# EasyEDA Pro project ProProject_minifoc_test_4.0_2024-05-25.epro

# Schematic schematic1_1
Create Date: 2024-03-08; Page Name: P1; Project Name: minifoc_test_4.0; Schematic Name: schematic1_1; Update Date: 2024-03-08; Company: 嘉立创EDA; Drawed: hlchen2021; Page Size: A4; Reviewed: hlchen2021; Version: V1.0
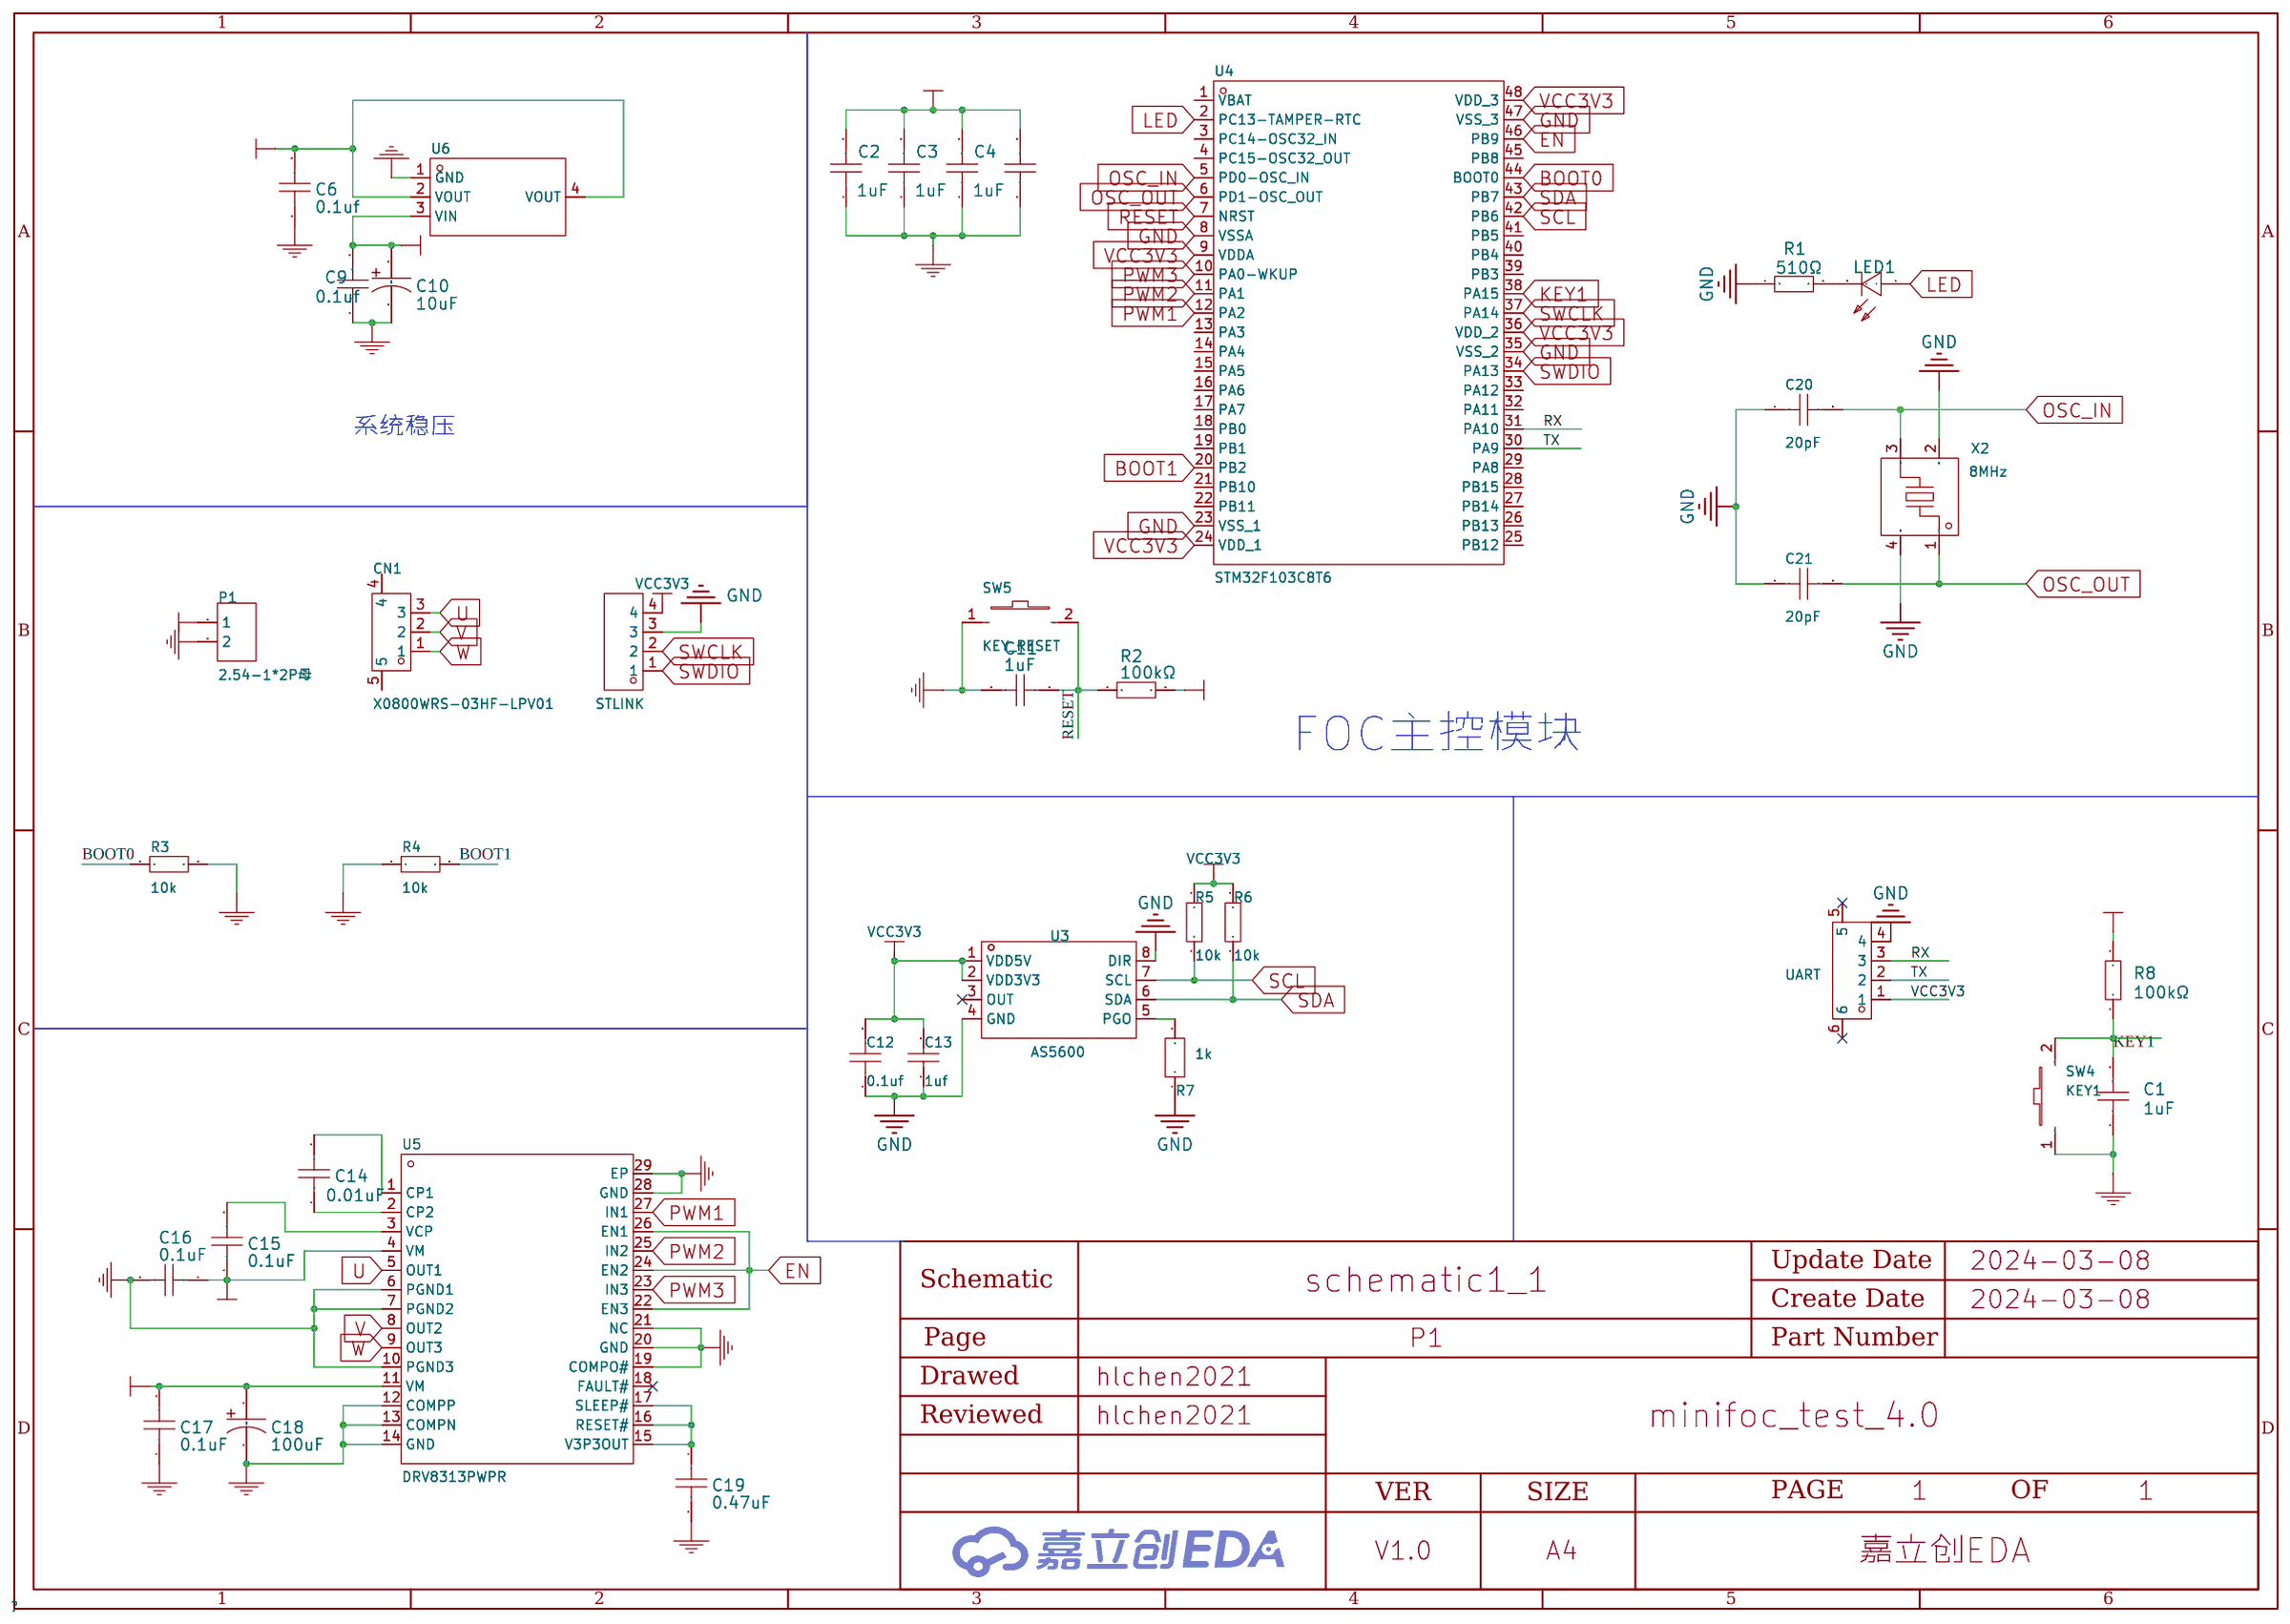
[diagram p0: schematic sheet]

## Parts
C1  1uF  [C0603]
C2  1uF  [C0603]
C3  1uF  [C0603]
C4  1uF  [C0603]
C5  1uF  [C0603]
C6  0.1uf  [C0603]
C9  0.1uf  [C0603]
C10  10uF  [CAP-SMD_L3.2-W1.6-RD]
C11  1uF  [C0603]
C12  100nF  [C0603]
C13  1uF  [C0603]
C14  0.01uF  [C0603]
C15  0.1uF  [C0603]
C16  0.1uF  [C0603]
C17  0.1uF  [C0603]
C18  100uF  [CAP-SMD_L6.0-W3.2-R-RD]
C19  0.47uF  [C0603]
C20  20pF  [C0603]
C21  20pF  [C0603]
CN1  X0800WRS-03HF-LPV01  [CONN-SMD_X0800WRS-03HF-LPV01]
LED1  FC-DA1608HRK-620D  [LED0603-FD]
P1  2.54-1*2P母  [HDR-TH_2P-P2.54-V-F]
R1  510Ω  [R0603]
R2  100kΩ  [R0603]
R3  10kΩ  [R0603]
R4  10kΩ  [R0603]
R5  10kΩ  [R0603]
R6  10kΩ  [R0603]
R7  1k  [R0603]
R8  100kΩ  [R0603]
STLINK  2.54-1*4P反弯排针  [HDR-TH_4P-P2.54-H-M-W10.4]
SW4  KEY1  [SW-SMD_L4.0-W2.9-LS5.0]
SW5  KEY_RESET  [SW-SMD_L4.0-W2.9-LS5.0]
U3  AS5600  [SOIC-8_L5.0-W4.0-P1.27-LS6.0-BL]
U4  STM32F103C8T6  [LQFP-48_L7.0-W7.0-P0.50-LS9.0-BL]
U5  DRV8313PWPR  [HTSSOP-28_L9.8-W4.5-P0.65-LS6.6-BL-EP]
U6  AMS1117-3.3  [SOT-223-3_L6.5-W3.4-P2.30-LS7.0-BR]
UART  HDGC1002WR-S-4P  [CONN-SMD_4P-P1.00_HDGC_HDGC1002WR-S-4P]
X2  8MHz  [OSC-SMD_4P-L3.2-W2.5-BL]

## Library data of the parts
C1-C5 C11 C13 = 0603F105M160NT: 容值:1uF;精度:±20%;额定电压:16V;材质(温度系数):Y5V;; LCSC Part Name: 1uF ±20% 16V; Supplier Part: C1689; Manufacturer: FH(风华); Supplier Footprint: 0603; JLCPCB Part Class: Extended Part; Datasheet: https://atta.szlcsc.com/upload/public/pdf/source/20170923/C1689_1506149319442988473.pdf; Supplier: LCSC; Tolerance: ±20%; Voltage Rated: 16V; Temperature Coefficient: Y5V
C6 C9 = 0.1uf
C10 = TC212A106M010A: Supplier: LCSC; Manufacturer: Sunlord; Supplier Part: C97063; JLCPCB Part Class: Extended Part
C12 = CC0603KRX7R9BB104: 容值:100nF;精度:±10%;额定电压:50V;材质(温度系数):X7R;; LCSC Part Name: 100nF ±10% 50V; Supplier Part: C14663; Manufacturer: YAGEO(国巨); Supplier Footprint: 0603; JLCPCB Part Class: Basic Part; Datasheet: https://atta.szlcsc.com/upload/public/pdf/source/20170116/1484561234239.pdf; Supplier: LCSC; Tolerance: ±10%; Voltage Rated: 50V; Temperature Coefficient: X7R
C14 = 0.01uF
C15-C17 = 0.1uF
C18 = CA45-C-10V-100μF-K: Supplier: LCSC; Manufacturer: TORCH; Supplier Part: C171664; JLCPCB Part Class: Extend
C19 = 0.47uF
C20 C21 = 0603CG200J101NT: 容值:20pF;精度:±5%;额定电压:100V;材质(温度系数):C0G;额定电压(VAC):-;; LCSC Part Name: 20pF ±5% 100V; Supplier Part: C2762329; Manufacturer: FH(风华); Supplier Footprint: 0603; JLCPCB Part Class: 扩展库; Datasheet: https://atta.szlcsc.com/upload/public/pdf/source/20211026/1B9CC6FF40D574A190437DF0D5F8F6A6.pdf; Supplier: LCSC; Tolerance: ±5%; Voltage Rated: 100V; Temperature Coefficient: C0G
CN1 = X0800WRS-03HF-LPV01: 插针结构:1x3P;间距:0.8mm;安装方式:卧贴;行距:-;总PIN数:3P;排数:1;每排PIN数:3;参考系列:-;额定电流:500mA;触头材质:磷青铜;触头镀层:金;工作温度范围:-25℃~+85℃;; LCSC Part Name: 1x3P 间距:0.8mm 卧贴 镀金 替代JST; Supplier Part: C500138; Manufacturer: XKB Connectivity(中国星坤); Supplier Footprint: SMD,P=0.8mm,卧贴; JLCPCB Part Class: 扩展库; Datasheet: https://atta.szlcsc.com/upload/public/pdf/source/20211011/3A0802A09DD608D3DCC2D13C156B7911.pdf; Supplier: LCSC; Pins Structure: 1x3P; Pitch: 0.8mm; Mounting Style: 卧贴; Number of Pins: 3P; Number of Rows: 1; Number of PINs Per Row: 3; Current Rating (Max): 500mA; Contact Material: 磷青铜; Contact Plating: 金; Operating Temperature Range: -25℃~+85℃
LED1 = FC-DA1608HRK-620D: Supplier: LCSC; Manufacturer: NATIONSTAR; Supplier Part: C84263; JLCPCB Part Class: Extended Part
P1 = 2.54-1*2P母: 排数:单排;总孔位数:2P;间距:2.54mm;插孔结构:1x2P;行距:-;安装类型:直插;塑高:-;触头材质:-;触头镀层:-;; LCSC Part Name: 间距:2.54mm 1x2P 直插; Supplier Part: C49661; Manufacturer: BOOMELE(博穆精密); Supplier Footprint: 插件,P=2.54mm; Datasheet: https://atta.szlcsc.com/upload/public/pdf/source/20210301/C2718488_F4427B881E42CAA8DDB0B1C12B3A522C.pdf; Supplier: LCSC; Number of Rows: 单排; Number of Holes: 2P; Pitch: 2.54mm; Holes Structure: 1x2P; Mounting Type: 直插
R1 = RS-03K511JT: Supplier: LCSC; Manufacturer: FH; Supplier Part: C73811; Resistance: 510; JLCPCB Part Class: Extended Part
R2 R8 = HoLTT0603-1/10W-100KR-1%: 阻值:100kΩ;功率:100mW;; LCSC Part Name: 100kΩ 100mW; Supplier Part: C2904537; Manufacturer: Milliohm(毫欧); Supplier Footprint: 0603; JLCPCB Part Class: Extended Part; Datasheet: https://atta.szlcsc.com/upload/public/pdf/source/20211021/528351F376078D6228C985A842C3763C.pdf; Supplier: LCSC; Power(Watts): 100mW
R3-R6 = 0603WAF1002T5E: 电阻类型:厚膜电阻;阻值:10kΩ;精度:±1%;功率:100mW;温度系数:±100ppm/;最大工作电压:75V;工作温度范围:-55~+155;; LCSC Part Name: 10kΩ ±1% 100mW; Supplier Part: C25804; Manufacturer: UNI-ROYAL(厚声); Supplier Footprint: 0603; JLCPCB Part Class: 基础库; Datasheet: https://atta.szlcsc.com/upload/public/pdf/source/20200306/C422600_1E6D84923E4A46A82E41ADD87F860B5C.pdf; Supplier: LCSC; Type: 厚膜电阻; Tolerance: ±1%; Power(Watts): 100mW; Temperature Coefficient: ±100ppm/; Overload Voltage (Max): 75V; Operating Temperature Range: -55~+155
R7 = SCR0603J1K: LCSC Part Name: ±5% 1K; Supplier Part: C3017736; Manufacturer: VO(翔胜); Supplier Footprint: 0603; JLCPCB Part Class: Extended Part; Datasheet: https://atta.szlcsc.com/upload/public/pdf/source/20220513/247AF9639BA21CF93567DC289CCC6A22.pdf; Supplier: LCSC
STLINK = 2.54-1*4P反弯排针: 间距:2.54mm;总PIN位数:4;排数:1;插针结构:1x4P;行距:-;安装类型:弯插;圆针/方针:方针;额定电流:3A;额定电压:-;配合针长度:6mm;塑高:-;端接针长度:-;触头材质:-;触头镀层:-;工作温度范围:-55~+105;颜色:黑色;; LCSC Part Name: 2.54mm 1x4P 弯插 方针; Supplier Part: C91552; Manufacturer: BOOMELE(博穆精密); Supplier Footprint: 弯插,P=2.54mm; JLCPCB Part Class: Extended Part; Datasheet: https://atta.szlcsc.com/upload/public/pdf/source/20190508/C74252_03DDEC4696EE17172E44B96636392962.pdf; Supplier: LCSC; Pitch: 2.54mm; Number of Pins: 4; Number of Rows: 1; Pin Structure: 1x4P; Mounting Type: 弯插; Circluar Pins/Square Pins: 方针; Current Rating (Max): 3A; Length of Mating Pin: 6mm; Operating Temperature Range: -55~+105; Color: 黑色
SW4 SW5 = KEY-3*4*2: Supplier Part: C9900015662; Supplier Footprint: KEY; JLCPCB Part Class: 扩展库; Datasheet: https://atta.szlcsc.comnull; Supplier: LCSC
U3 = AS5600-ASOM: 非接触12bit磁角度位置传感器; Supplier Part: C79815; Manufacturer: ams(艾迈斯半导体); Supplier Footprint: SOIC-8_150mil; JLCPCB Part Class: 扩展库; Datasheet: https://atta.szlcsc.com/upload/public/pdf/source/20161027/1477535527192.pdf; Supplier: LCSC
U4 = STM32F103C8T6: CPU内核:ARM Cortex-M3;CPU最大主频:72MHz;工作电压范围:2V~3.6V;内部振荡器:有;程序 FLASH容量:64K@x8bit;RAM总容量:20KB;EEPROM/数据 FLASH容量:-;GPIO端口数量:37;ADC(单元数/通道数/位数):1@x10ch/12bit;外设/功能/协议栈:温度传感器；DMA；看门狗；POR；PWM;工作温度范围:-40~+85;; LCSC Part Name: ARM Cortex-M3 72MHz 64K@x8bit 20KB MSL=3; Supplier Part: C8734; Manufacturer: ST(意法半导体); Supplier Footprint: LQFP-48_7x7x05P; JLCPCB Part Class: 基础库; Datasheet: https://atta.szlcsc.com/upload/public/pdf/source/20140724/1457707174202.pdf; Supplier: LCSC; CPU Core: ARM Cortex-M3; Maximum Frequency: 72MHz; Supply Voltage Range: 2V~3.6V; Internal Oscillator: 有; Program FLASH Size: 64K@x8bit; RAM Size: 20KB; GPIO Ports Number: 37; ADC (Units/Channels/bits): 1@x10ch/12bit; Peripherals / Functions / Protocol Stacks: 温度传感器；DMA；看门狗；POR；PWM; Operating Temperature Range: -40~+85
U5 = DRV8313PWPR: DRV8313 三路 1/2 H 桥驱动器 IC; Supplier Part: C92482; Manufacturer: TI(德州仪器); Supplier Footprint: HTSSOP-28; JLCPCB Part Class: 扩展库; Datasheet: https://atta.szlcsc.com/upload/public/pdf/source/20180307/C92482_15204091381071407760.pdf; Supplier: LCSC
U6 = AMS1117-3.3_C6186: 输出类型:固定;输出极性:正;输出通道数:1;最大输入电压:-;输出电压:3.3V;压差:1.3V@(800mA);静态电流(地电流):-;输出电流:1A;电源纹波抑制比(PSRR):72dB@(120Hz);噪声:-;特性:-;工作温度:-;; LCSC Part Name: Vout=3.3V 1A 72dB@(120Hz); Supplier Part: C6186; Manufacturer: 美国AMS; Supplier Footprint: SOT-223; JLCPCB Part Class: Basic Part; Datasheet: https://atta.szlcsc.com/upload/public/pdf/source/20180727/C6186_7A095716F0823C02F1997A905E26C086.pdf; Supplier: LCSC; Output Type: 固定; Output Polarity: 正; Number of Outputs: 1; Output Voltage: 3.3V; Dropout Voltage: 1.3V@(800mA); Output Current: 1A; Power Supply Rejection Ratio (PSRR): 72dB@(120Hz)
UART = HDGC1002WR-S-4P: 参考系列:-;间距:1mm;插针结构:1x4P;排数:1;每排PIN数:4;行距:-;公母:公型插针;安装方式:卧贴;额定电流:1A;工作温度范围:-25~+70;; LCSC Part Name: SH1.0针座卧贴 4P; Supplier Part: C2936214; Manufacturer: HDGC(华德共创); Supplier Footprint: SMD,P=1mm; JLCPCB Part Class: 扩展库; Datasheet: https://atta.szlcsc.com/upload/public/pdf/source/20211229/E8A09E85670B5E97244D2008A24D97FE.pdf; Supplier: LCSC; Pitch: 1mm; Pins Structure: 1x4P; Number of Rows: 1; Number of PINs Per Row: 4; Gender: 公型插针; Mounting Style: 卧贴; Current Rating (Max): 1A; Operating Temperature Range: -25~+70
X2 = 3225-8.00-10-10-10/A: 晶振类型:贴片无源晶振;频率:8MHz;频率公差:±10ppm;频率稳定度:-;负载电容:10pF;工作温度:-;; LCSC Part Name: 8MHz ±10ppm 10pF; Supplier Part: C518154; Manufacturer: LIMING(利明); Supplier Footprint: SMD3225-4P; JLCPCB Part Class: 扩展库; Datasheet: https://atta.szlcsc.com/upload/public/pdf/source/20200603/C518143_C28693AFC6B5677A46756E3C75F63174.pdf; Supplier: LCSC; Crystal Type: 贴片无源晶振; Frequency Tolerance: ±10ppm; Load Capacitance: 10pF

## Nets
GND: C1.1 C2.1 C3.1 C4.1 C5.1 C6.1 C9.1 C10.2 C11.1 C12.1 C13.1 C16.2 C17.1 C18.2 C19.2 C20.1 C21.1 P1.2 R1.1 R3.2 R4.1 R7.1 STLINK.3 SW4.1 SW5.1 U3.4(GND) U3.8(DIR) U4.8(VSSA) U4.23(VSS_1) U4.35(VSS_2) U4.47(VSS_3) U5.6(PGND1) U5.7(PGND2) U5.10(PGND3) U5.12(COMPP) U5.13(COMPN) U5.14(GND) U5.19(COMPO#) U5.20(GND) U5.21(NC) U5.28(GND) U5.29(EP) U6.1(GND) UART.4 X2.2(GND) X2.4(GND)
VCC: C9.2 C10.1 C15.1 C16.1 C17.2 C18.1 P1.1 U5.4(VM) U5.11(VM) U6.3(VIN)
VCC3V3: C2.2 C3.2 C4.2 C5.2 C6.2 C12.2 C13.2 R2.2 R5.2 R6.2 R8.2 STLINK.4 U3.1(VDD5V) U3.2(VDD3V3) U4.9(VDDA) U4.24(VDD_1) U4.36(VDD_2) U4.48(VDD_3) U6.2(VOUT) U6.4(VOUT) UART.1
BOOT0: R3.1 U4.44(BOOT0)
BOOT1: R4.2 U4.20(PB2)
EN: U4.46(PB9) U5.22(EN3) U5.24(EN2) U5.26(EN1)
KEY1: C1.2 R8.1 SW4.2 U4.38(PA15)
LED: LED1.1(A) U4.2(PC13-TAMPER-RTC)
OSC_IN: C20.2 U4.5(PD0-OSC_IN) X2.3
OSC_OUT: C21.2 U4.6(PD1-OSC_OUT) X2.1
PWM1: U4.12(PA2) U5.27(IN1)
PWM2: U4.11(PA1) U5.25(IN2)
PWM3: U4.10(PA0-WKUP) U5.23(IN3)
RESET: C11.2 R2.1 SW5.2 U4.7(NRST)
RX: U4.31(PA10) UART.3
SCL: R5.1 U3.7(SCL) U4.42(PB6)
SDA: R6.1 U3.6(SDA) U4.43(PB7)
SWCLK: STLINK.2 U4.37(PA14)
SWDIO: STLINK.1 U4.34(PA13)
TX: U4.30(PA9) UART.2
U: CN1.3 U5.5(OUT1)
V: CN1.2 U5.8(OUT2)
W: CN1.1 U5.9(OUT3)
$1N6846: LED1.2(K) R1.2
$1N8586: C14.2 U5.1(CP1)
$1N8587: C14.1 U5.2(CP2)
$1N8589: C15.2 U5.3(VCP)
$1N8596: C19.1 U5.15(V3P3OUT) U5.16(RESET#) U5.17(SLEEP#)
$1N18711: R7.2 U3.5(PGO)

Not connected (* = marked no-connect by the designer): CN1 4 5; U3 3(OUT)*; U4 1(VBAT) 3(PC14-OSC32_IN) 4(PC15-OSC32_OUT) 13(PA3) 14(PA4) 15(PA5) 16(PA6) 17(PA7) 18(PB0) 19(PB1) 21(PB10) 22(PB11) 25(PB12) 26(PB13) 27(PB14) 28(PB15) 29(PA8) 32(PA11) 33(PA12) 39(PB3) 40(PB4) 41(PB5) 45(PB8); U5 18(FAULT#)*; UART 5* 6*

## Notes on the sheet
- 系统稳压
- FOC主控模块

# Board PCB1_1
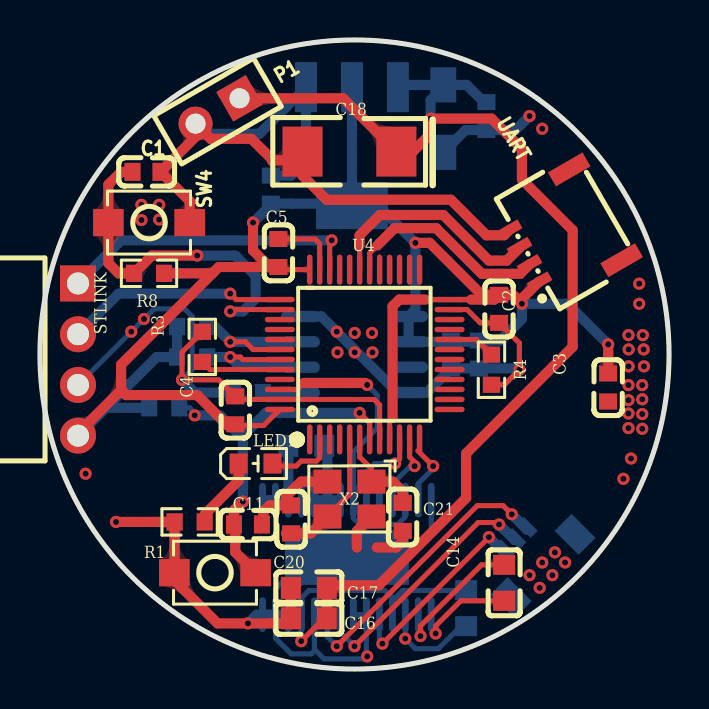
[diagram p1: board, top side]
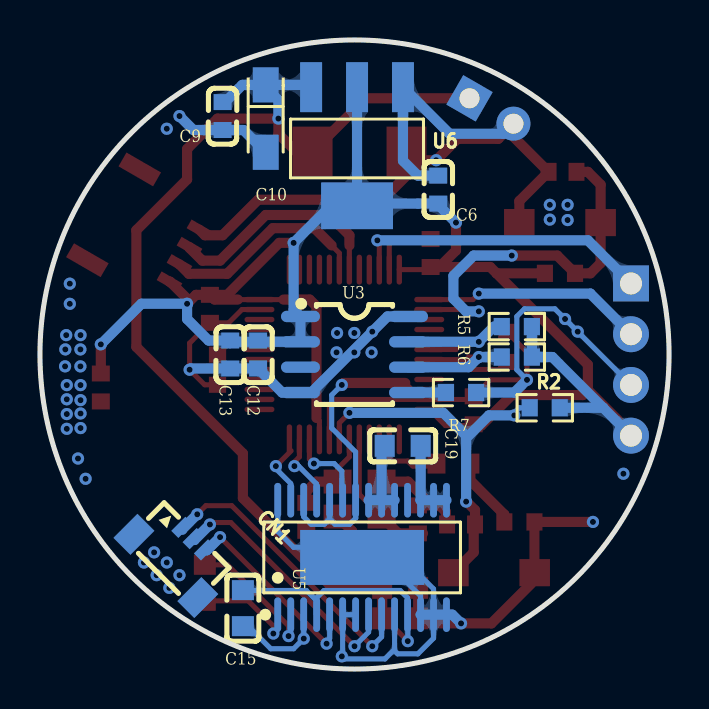
[diagram p2: board, bottom side, seen from below]

Outline 31.5 x 31.5 mm; copper layers: Top Layer, Bottom Layer. Coordinates in mm from the lower left corner of the outline.
Outline path: circle c15.75,15.75 r15.75
Stack: Top Layer 0.035mm - / Dielectric1 1.51mm FR4 er 4.5 / Bottom Layer 0.035mm -

## Design rules (mm)
template: 用户自定义配置
spacing safeClearance (default): track to track 0.152, other pairs 0.152 to 0.3
track width trackWidth (default): min 0.127, default 0.254, max 2.54
differential pair differentialPair (default): width min 0.127, default 0.254, max 2.54; gap min 0.152, default 0.152
via viaSize (default): diameter min 0.5, default 0.61, max 10; hole min 0.3, default 0.305, max 5.999

## Placement (name value [footprint] x y rotation side)
C1  1uF  [C0603#2]  5.33 24.89 180 top
C2  1uF  [C0603#2]  22.99 18.03 90 top
C3  1uF  [C0603#2]  28.45 14.1 90 top
C4  1uF  [C0603#2]  9.78 12.95 270 top
C5  1uF  [C0603#2]  11.94 20.83 270 top
C6  0.1uf  [C0603#2]  11.56 24 270 bottom
C9  0.1uf  [C0603#2]  22.35 27.69 90 bottom
C10  10uF  [CAP-SMD_L3.2-W1.6-RD]  20.19 27.56 270 bottom
C11  1uF  [C0603#2]  10.41 7.24 180 top
C12  100nF  [C0603#2]  20.57 15.75 90 bottom
C13  1uF  [C0603#2]  21.97 15.75 90 bottom
C14  0.01uF  [C0603]  23.24 4.32 270 top
C15  0.1uF  [C0603]  21.34 3.05 270 bottom
C16  0.1uF  [C0603]  13.46 2.54 180 top
C17  0.1uF  [C0603]  13.46 4.06 0 top
C18  100uF  [CAP-SMD_L6.0-W3.2-R-RD]  15.49 25.91 0 top
C19  0.47uF  [C0603]  13.33 11.18 0 bottom
C20  20pF  [C0603#2]  12.57 7.49 270 top
C21  20pF  [C0603#2]  18.16 7.62 90 top
CN1  X0800WRS-03HF-LPV01  [CONN-SMD_X0800WRS-03HF-LPV01]  24.51 5.84 225 bottom
LED1  FC-DA1608HRK-620D  [LED0603-FD]  10.79 10.29 180 top
P1  2.54-1*2P母  [HDR-TH_2P-P2.54-V-F]  8.89 27.94 210 top
R1  510Ω  [R0603]  7.49 7.37 0 top
R2  100kΩ  [R0603]  6.22 13.08 180 bottom
R3  10kΩ  [R0603]  8.13 16.13 90 top
R4  10kΩ  [R0603]  22.61 14.99 90 top
R5  10kΩ  [R0603]  7.62 17.14 180 bottom
R6  10kΩ  [R0603]  7.62 15.62 180 bottom
R7  1k  [R0603]  10.41 13.84 0 bottom
R8  100kΩ  [R0603]  5.46 19.81 0 top
STLINK  2.54-1*4P反弯排针  [HDR-TH_4P-P2.54-H-M-W10.4]  1.91 15.49 270 top
SW4  KEY1  [SW-SMD_L4.0-W2.9-LS5.0]  5.46 22.35 180 top
SW5  KEY_RESET  [SW-SMD_L4.0-W2.9-LS5.0]  8.76 4.83 0 top
U3  AS5600  [SOIC-8_L5.0-W4.0-P1.27-LS6.0-BL]  15.75 15.75 270 bottom
U4  STM32F103C8T6  [LQFP-48_L7.0-W7.0-P0.50-LS9.0-BL]  16.26 15.75 0 top
U5  DRV8313PWPR  [HTSSOP-28_L9.8-W4.5-P0.65-LS6.6-BL-EP]  15.37 5.59 180 bottom
U6  AMS1117-3.3  [SOT-223-3_L6.5-W3.4-P2.30-LS7.0-BR]  15.62 26.16 90 bottom
UART  HDGC1002WR-S-4P  [CONN-SMD_4P-P1.00_HDGC_HDGC1002WR-S-4P]  26.03 21.72 120 top
X2  8MHz  [OSC-SMD_4P-L3.2-W2.5-BL]  15.49 8.51 180 top

## Footprints (pads in the part's own frame, mm; a bottom-side part is the same pattern mirrored in y, then rotated)
C0603
  rect 1x1.1 smd: 1(-0.9,0) 2(0.9,0)
C0603#2
  rect 0.8x0.9 smd: 1(-0.7,0) 2(0.7,0)
CAP-SMD_L3.2-W1.6-RD
  rect 1.758x1.296 smd: 1(-1.687,0) 2(1.687,0)
CAP-SMD_L6.0-W3.2-R-RD
  rect 2x2.5 smd: 1(2.35,0) 2(-2.35,0)
CONN-SMD_4P-P1.00_HDGC_HDGC1002WR-S-4P
  rect 0.5x1.2 smd: 1(-1.5,2.05) 2(-0.5,2.05) 3(0.5,2.05) 4(1.5,2.05)
  rect 0.8x2 smd: 5(2.625,-2.05) 6(-2.625,-2.05)
CONN-SMD_X0800WRS-03HF-LPV01
  rect 0.5x1 smd: 1(-0.8,0.973) 2(0,0.973) 3(0.8,0.973)
  rect 1.2x1.7 smd: 4(2.25,-0.95) 5(-2.25,-0.973)
HDR-TH_2P-P2.54-V-F
  rect 1.7x1.7 hole 1: 1(-1.27,0)
  round 1.7 hole 1: 2(1.27,0)
HDR-TH_4P-P2.54-H-M-W10.4
  rect 1.8x1.8 hole 1.1: 1(-3.81,0)
  round 1.8 hole 1.1: 2(-1.27,0) 3(1.27,0) 4(3.81,0)
HTSSOP-28_L9.8-W4.5-P0.65-LS6.6-BL-EP
  oval 0.343x1.732 smd: 1(-4.224,-2.865) 2(-3.574,-2.865) 3(-2.926,-2.865) 4(-2.276,-2.865) 5(-1.625,-2.865) 6(-0.976,-2.865) 7(-0.325,-2.865) 8(0.325,-2.865) 9(0.976,-2.865) 10(1.625,-2.865) 11(2.276,-2.865) 12(2.926,-2.865) 13(3.576,-2.865) 14(4.224,-2.865) 15(4.224,2.865) 16(3.576,2.865) 17(2.926,2.865) 18(2.276,2.865) 19(1.625,2.865) 20(0.976,2.865) 21(0.325,2.865) 22(-0.325,2.865) 23(-0.976,2.865) 24(-1.625,2.865) 25(-2.276,2.865) 26(-2.926,2.865) 27(-3.574,2.865) 28(-4.224,2.865)
  rect 6.2x2.751 smd: 29(0,0)
LED0603-FD
  rect 0.9x1 smd: 1(-0.85,0) 2(0.85,0)
LQFP-48_L7.0-W7.0-P0.50-LS9.0-BL
  oval 0.27x1.5 smd: 1(-2.75,-4.25) 2(-2.25,-4.25) 3(-1.75,-4.25) 4(-1.25,-4.25) 5(-0.75,-4.25) 6(-0.25,-4.25) 7(0.25,-4.25) 8(0.75,-4.25) 9(1.25,-4.25) 10(1.75,-4.25) 11(2.25,-4.25) 12(2.75,-4.25) 25(2.75,4.25) 26(2.25,4.25) 27(1.75,4.25) 28(1.25,4.25) 29(0.75,4.25) 30(0.25,4.25) 31(-0.25,4.25) 32(-0.75,4.25) 33(-1.25,4.25) 34(-1.75,4.25) 35(-2.25,4.25) 36(-2.75,4.25)
  oval 1.5x0.27 smd: 13(4.25,-2.75) 14(4.25,-2.25) 15(4.25,-1.75) 16(4.25,-1.25) 17(4.25,-0.75) 18(4.25,-0.25) 19(4.25,0.25) 20(4.25,0.75) 21(4.25,1.25) 22(4.25,1.75) 23(4.25,2.25) 24(4.25,2.75) 37(-4.25,2.75) 38(-4.25,2.25) 39(-4.25,1.75) 40(-4.25,1.25) 41(-4.25,0.75) 42(-4.25,0.25) 43(-4.25,-0.25) 44(-4.25,-0.75) 45(-4.25,-1.25) 46(-4.25,-1.75) 47(-4.25,-2.25) 48(-4.25,-2.75)
OSC-SMD_4P-L3.2-W2.5-BL
  rect 1.4x1.2 smd: 1(-1.1,-0.875) 2(1.1,-0.875) 3(1.1,0.875) 4(-1.1,0.875)
R0603
  rect 0.806x0.864 smd: 1(-0.753,0) 2(0.753,0)
SOIC-8_L5.0-W4.0-P1.27-LS6.0-BL
  oval 0.569x1.95 smd: 1(-1.905,-2.705) 2(-0.635,-2.705) 3(0.635,-2.705) 4(1.905,-2.705) 5(1.905,2.705) 6(0.635,2.705) 7(-0.635,2.705) 8(-1.905,2.705)
SOT-223-3_L6.5-W3.4-P2.30-LS7.0-BR
  rect 2.5x1.1 smd: 1(2.97,-2.3) 2(2.97,0) 3(2.97,2.3)
  rect 2.34x3.6 smd: 4(-2.97,0)
SW-SMD_L4.0-W2.9-LS5.0
  rect 1.53x1.36 smd: 1(-2.035,0) 2(2.035,0)

## Nets
As in the schematic.

Pads without a net: CN1 4 5; U3 3; U4 1 3 4 13 14 15 16 17 18 19 21 22 25 26 27 28 29 32 33 39 40 41 45; U5 18; UART 5 6

## Via types
v1: diameter 0.61, hole 0.305, Top Layer to Bottom Layer, 73 vias

## Routing (per net, layer and track width the routed paths; a pad name or vN(x,y) marks a point on that pad's centre or on a via; arc(x,y) is an arc through that point)
GND: length 152.3
  Top Layer w0.254: 12.44,2.54 12.45,2.53 12.45,2.29 ; 6.74,4.84 SW5.1 ; U4.23 21.38,18 22.05,17.33 C2.1 24,16.32 v1(24,14.99) 23.25,14.23 R4.1 ; U4.35 14.01,21.3 13.78,21.53 C5.1 ; U4.8 17.01,13.22 16.73,13.5 U4.47 9.94,13.5 C4.1 8.95,14.48 v1(7.11,14.48) 7.11,15.87 R3.2 ; v1(10.41,2.29) 10.41,2.41
  Top Layer w0.508: C21.1 18.16,6.41 17.84,6.09 16.87,6.09 ; UART.4 23.24,21.72 22.35,21.72 20.57,23.49 14.35,23.49 13.14,24.7 C18.2 12.71,25.48 v1(11.66,25.48) 10.59,26.54 8.55,26.54 P1.2 7.79,26.65 C1.1 7.5,23.43 SW4.1 ; v1(3.81,7.37) R1.1 6.74,4.84 ; 12.45,2.29 v1(10.41,2.29) 8.89,2.29 6.73,4.45 SW5.1 ; X2.4 15.87,6.91 15.87,6.09 ; 12.56,4.19 12.56,2.29 ; C11.1 11.18,7.3 11.18,7.87 11.5,8.19 12.32,8.19 12.32,8.64 13.07,9.38 X2.2
  Bottom Layer w0.254: 13.87,5.09 12.44,3.66 U5.12 ; 14.87,6.09 14.99,5.97 ; 14.99,5.97 15.11,5.97 ; 14.99,5.97 13.84,5.97 ; 15.11,5.97 16.11,5.97 16.11,5.33 15.87,5.09 ; 15.11,5.97 15.11,5.33 14.87,5.09 ; 16.87,6.09 16.87,6.1 18.8,6.1 19.59,6.89 U5.28 ; v1(7.11,14.48) 7.62,14.99 7.62,17.65 7.24,18.03 5.72,18.03 v1(5.21,17.53) v1(4.57,16.89) STLINK.3 ; 13.74,0.99 U5.10 ; 13.74,0.99 14.22,0.51 16.26,0.51 v1(16.38,0.63) 16.34,0.68 U5.6 U5.7 ; 13.74,0.99 13.74,0.91 13.59,0.76 12.57,0.76 11.79,1.54 U5.13 11.79,4.01 13.87,6.09 ; v1(10.41,2.29) 10.41,2.41
  Bottom Layer w0.508: v1(10.41,2.29) 10.85,2.72 U5.14 U5.13 U5.12 ; U5.20 14.39,11.02 C19.2 ; U5.20 U5.19 ; U5.20 U5.21 ; v1(24.51,27.69) 23.81,26.99 C9.1 21.31,26.99 C10.2 ; P1.2 8.3,26.8 10.99,26.8 U6.1 13.32,25.45 12.57,24.7 C6.1 ; v1(24,14.99) 23.94,15.05 C13.1 C12.1 19.37,13.84 U3.4 17.91,13.84 v1(14.86,16.89) 14.1,17.65 U3.8 ; R7.1 7.75,13.84 v1(7.11,14.48) ; 11.64,25.46 v1(11.66,25.48)
  vias: v1(2.29,9.78) v1(5.08,23.24) v1(5.08,22.48) v1(5.97,23.24) v1(5.97,22.5) v1(14.89,15.85) v1(15.76,16.83) v1(15.76,15.85) v1(16.62,16.83) v1(16.65,15.85) v1(24.51,4.7) v1(25.02,4.06) v1(25.15,27.05) v1(25.15,5.33) v1(25.65,4.7) v1(25.78,5.84) v1(26.29,5.33) v1(29.21,9.52) v1(29.46,16.72) v1(29.47,16) v1(29.47,15.15) v1(29.46,14.22) v1(29.46,13.46) v1(29.46,12.79) v1(29.46,12.06) v1(29.59,10.54) v1(30,19.29) v1(30,18.29) v1(30.18,16.72) v1(30.15,14.22) v1(30.15,13.51) v1(30.15,12.77) v1(30.15,12.03) v1(30.23,16) v1(30.24,15.15)
VCC: length 69.6
  Top Layer w0.254: v1(13.08,1.4) 14.22,2.54 C16.1
  Top Layer w0.508: 14.36,2.29 14.36,4.19 16.97,4.19 21.34,8.56 21.34,10.79 26.67,16.13 26.67,21.97 24.13,24.51 24.13,26.03 22.61,27.56 v1(19.56,27.56) 19.56,26.8 18.67,25.91 C18.1 15.18,28.57 P1.1
  Bottom Layer w0.254: C15.1 21.32,3.93 18.16,3.93 17.65,3.43 17.65,2.73 U5.4 17.64,3.57 17.28,3.93 13.46,3.93 13.09,3.56 U5.11 13.08,2.71 v1(13.08,1.4)
  Bottom Layer w0.508: 22.35,28.26 21.37,29.25 20.32,29.25 ; U6.3 18.03,29.25 20.32,29.25 ; 20.32,29.25 19.56,28.48 v1(19.56,27.56)
VCC3V3: length 94.6
  Top Layer w0.254: 21.59,18.5 U4.24 19.3,18.5 ; 9.84,12.19 11.2,12.19 U4.48 ; U4.9 17.51,12.43 17.65,12.57 ; C5.2 12.07,20 U4.36
  Top Layer w0.508: C5.2 11.5,20.13 ; 11.5,20.13 8.95,20.13 8.64,19.81 ; 11.5,20.13 10.67,20.95 v1(10.67,22.35) ; STLINK.4 1.91,11.81 4.06,13.97 ; C4.2 9.78,12.25 9.84,12.19 9.4,12.19 7.87,13.72 4.32,13.72 4.06,13.97 ; 4.06,13.97 4.06,15.24 8.64,19.81 ; v1(18.8,21.34) 19.51,21.34 22.12,18.73 C2.2 ; 21.59,18.5 22.75,18.5 C2.2 ; UART.1 24.98,19.39 24.13,18.54 v1(24.13,18.29) 23.68,18.73 C2.2 ; v1(28.45,16.26) C3.2 ; 19.3,18.5 17.99,18.5 17.65,18.16 17.65,12.57 ; R8.2 8.64,19.81
  Bottom Layer w0.508: R5.2 R6.2 5.84,15.62 3.3,13.08 ; 3.3,13.08 STLINK.4 ; 3.3,13.08 R2.2 ; C13.2 23.05,16.45 24.13,17.53 v1(24.13,18.29) 26.42,18.29 v1(28.45,16.26) ; U6.4 16.94,23.19 v1(18.8,21.34) 18.8,18 U3.1 U3.2 21.91,16.38 21.97,16.32 ; U6.4 15.51,23.3 11.62,23.3 v1(10.67,22.35) ; U6.4 U6.2
BOOT0: length 4
  Top Layer w0.254: U4.44 8.9,15 8.89,14.99 8.52,14.99 R3.1
BOOT1: length 2.4
  Top Layer w0.254: R4.2 21.85,16.5 U4.20
EN: length 16.8
  Top Layer w0.254: U4.46 12.88,14 13.21,14.32
  Top Layer w0.508: v1(16.38,14.22) 16.28,14.32 13.21,14.32
  Bottom Layer w0.254: U5.24 16.99,7.52 ; 16.99,7.52 16.72,7.24 16,7.24 15.68,7.56 15.69,7.56 U5.22 15.69,10.87 16.89,12.06 16.89,13.72 v1(16.38,14.22) ; 16.99,7.52 17.27,7.24 17.91,7.24 18.29,7.62 U5.26
KEY1: length 19
  Top Layer w0.254: v1(9.52,17.91) 9.62,18 U4.38
  Top Layer w0.508: C1.2 4.06,24.89 3.43,24.25 SW4.2 3.43,20.32 3.94,19.81 R8.1 5.6,20.7 v1(7.87,20.7)
  Bottom Layer w0.508: v1(9.52,17.91) 10.16,17.91 10.79,18.54 10.79,19.68 9.78,20.7 v1(7.87,20.7)
LED: length 3.5
  Top Layer w0.254: 11.64,10.16 12.83,10.16 13.08,10.41 13.84,10.41 14.01,10.58 U4.2
OSC_IN: length 6.7
  Top Layer w0.254: U4.5 15.51,8.75 X2.3
  Top Layer w0.508: 12.32,6.79 13.55,6.79 X2.3
OSC_OUT: length 4.7
  Top Layer w0.254: U4.6 16.01,10.62 16.59,10.03 X2.1
  Top Layer w0.508: X2.1 17.67,9.38 18.16,8.89 C21.2
PWM1: length 3.1
  Top Layer w0.254: 18.92,10.92 v1(19.69,10.16)
  Bottom Layer w0.254: v1(19.69,10.16) 19.69,10.03 18.94,9.29 U5.27
PWM2: length 3.7
  Top Layer w0.254: v1(18.76,10.16) 18.76,10.37 18.51,10.62 U4.11
  Bottom Layer w0.254: U5.25 17.65,8.46 17.65,9.27 18.54,10.16 v1(18.76,10.16)
PWM3: length 3.9
  Top Layer w0.254: v1(17.78,10.29) 18.01,10.51 U4.10
  Bottom Layer w0.254: 16.34,8.83 16.38,8.87 16.38,9.91 16.76,10.29 v1(17.78,10.29)
RESET: length 19.3
  Top Layer w0.254: v1(16,12.83) 16.51,12.32 U4.7
  Top Layer w0.508: 9.78,7.3 9.78,5.84 SW5.2 ; v1(10.16,8.38) 10.14,8.38 9.71,7.96 C11.2
  Bottom Layer w0.254: v1(7.75,12.7) 7.75,12.83 7.49,13.08 R2.1
  Bottom Layer w0.508: 10.16,11.56 10.16,11.68 11.3,12.83 v1(16,12.83) ; 10.16,11.56 v1(10.16,8.38) ; 10.16,11.56 9.02,12.7 v1(7.75,12.7)
RX: length 11.4
  Top Layer w0.254: 16.01,21.21 16,21.21 16.01,21.2 U4.31
  Top Layer w0.508: 16,21.21 16,21.72 17.02,22.73 20.19,22.73 22.48,20.45 23.37,20.45 24.01,21.09 24.01,21.12
SCL: length 7.6
  Top Layer w0.254: U4.42 10.67,16 10.29,16.38 v1(9.52,16.38)
  Bottom Layer w0.508: R5.1 8.76,17.14 v1(9.52,16.38) U3.7
SDA: length 7.4
  Top Layer w0.254: v1(9.52,15.62) 10.03,15.62 10.16,15.49 12,15.49 U4.43
  Bottom Layer w0.508: R6.1 v1(9.52,15.62) 10.03,15.11 U3.6
SWCLK: length 11.1
  Top Layer w0.254: v1(9.52,18.8) 9.82,18.5 U4.37
  Bottom Layer w0.508: v1(9.52,18.8) 3.94,18.8 STLINK.2
SWDIO: length 15.1
  Top Layer w0.254: v1(14.6,21.46) 14.51,21.36 U4.34
  Bottom Layer w0.508: STLINK.1 4.06,21.46 v1(14.6,21.46)
TX: length 10.5
  Top Layer w0.254: U4.30 16.51,20.82 16.89,21.21
  Top Layer w0.508: 24.51,20.26 24.04,19.79 22.12,19.79 19.84,22.07 17.75,22.07 16.89,21.21
U: length 10.4
  Top Layer w0.254: v1(22.48,6.6) v1(17.14,1.27)
  Bottom Layer w0.254: v1(17.14,1.27) 17.14,1.37 16.99,1.53 16.99,3.1
  Bottom Layer w0.508: v1(22.48,6.6) 23.14,5.95 23.15,5.95
V: length 13.2
  Top Layer w0.254: v1(22.99,7.24) 22.89,7.33 21.94,7.33 v1(15.75,1.14)
  Bottom Layer w0.254: 15.04,3.1 15.04,1.85 v1(15.75,1.14)
  Bottom Layer w0.508: 23.76,6.46 23.76,6.47 v1(22.99,7.24)
W: length 15.1
  Top Layer w0.254: v1(23.62,7.75) 23.19,8.18 21.89,8.18 v1(14.86,1.14)
  Bottom Layer w0.254: 14.39,3.1 14.39,1.61 v1(14.86,1.14)
  Bottom Layer w0.508: v1(23.62,7.75) 24.37,7 24.37,6.97
$1N6846: length 3.6
  Top Layer w0.508: R1.2 8.25,7.74 9.94,9.44 LED1.2
$1N8586: length 5.7
  Top Layer w0.254: v1(19.81,1.78) 19.81,2.16 21.07,3.42 C14.2
  Bottom Layer w0.254: 19.59,3.1 19.59,2 v1(19.81,1.78)
$1N8587: length 7.5
  Top Layer w0.254: v1(19.05,1.65) 19.05,2.16 22.11,5.22 C14.1
  Bottom Layer w0.254: v1(19.05,1.65) 18.94,1.76 18.94,3.1
$1N8589: length 5.2
  Bottom Layer w0.254: 18.29,3.1 18.29,1.53 v1(18.29,1.52) 18.8,1.02 19.94,1.02 21.08,2.16 21.08,2.27
$1N8596: length 4
  Bottom Layer w0.508: U5.15 U5.16 U5.17 12.44,8.46 12.44,11.18
$1N18711: length 1.9
  Bottom Layer w0.508: U3.5 R7.2

## Copper pours and planes (outline as drawn; the poured copper is in the pictures)
GND on Top Layer: -12.95,43.43 37.85,43.43 37.85,-9.91 -12.95,-9.91
GND on Bottom Layer: -15.11,46.23 35.69,46.23 35.69,-7.24 -15.11,-7.24

Small or netless copper shapes (teardrops, artwork), in the pictures only: 116 on Top Layer, 136 on Bottom Layer
